# EasyEDA Pro project 鱼缸控制器(e-ink).epro, board 控制板pcb
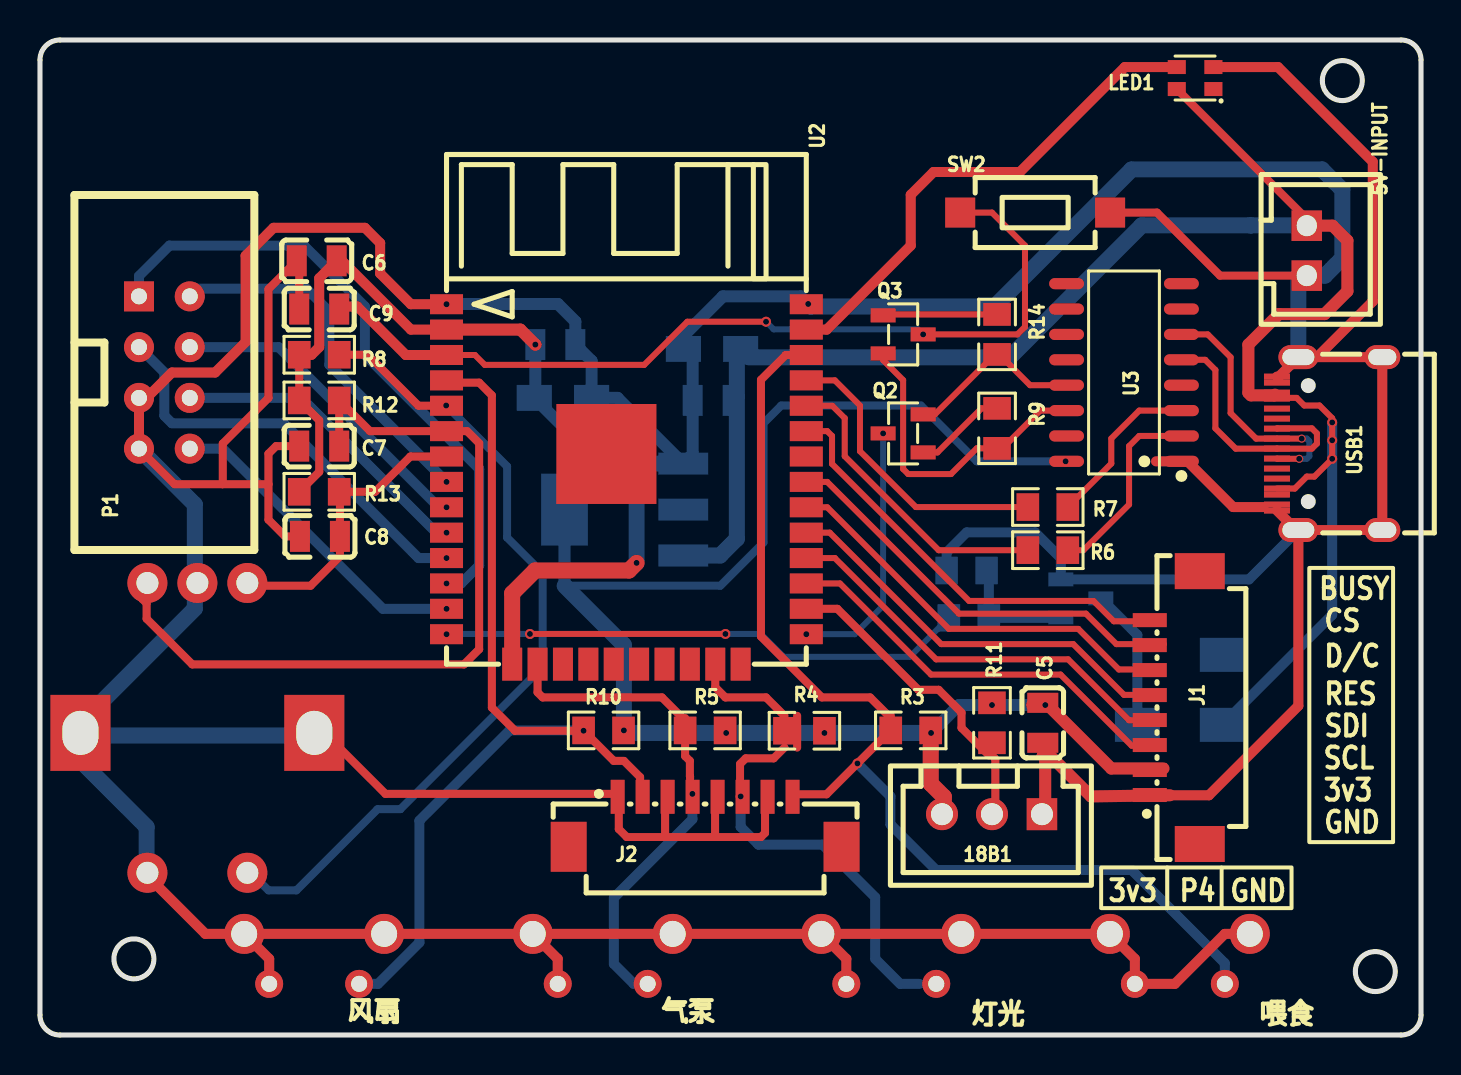
[diagram p4: board, top side]
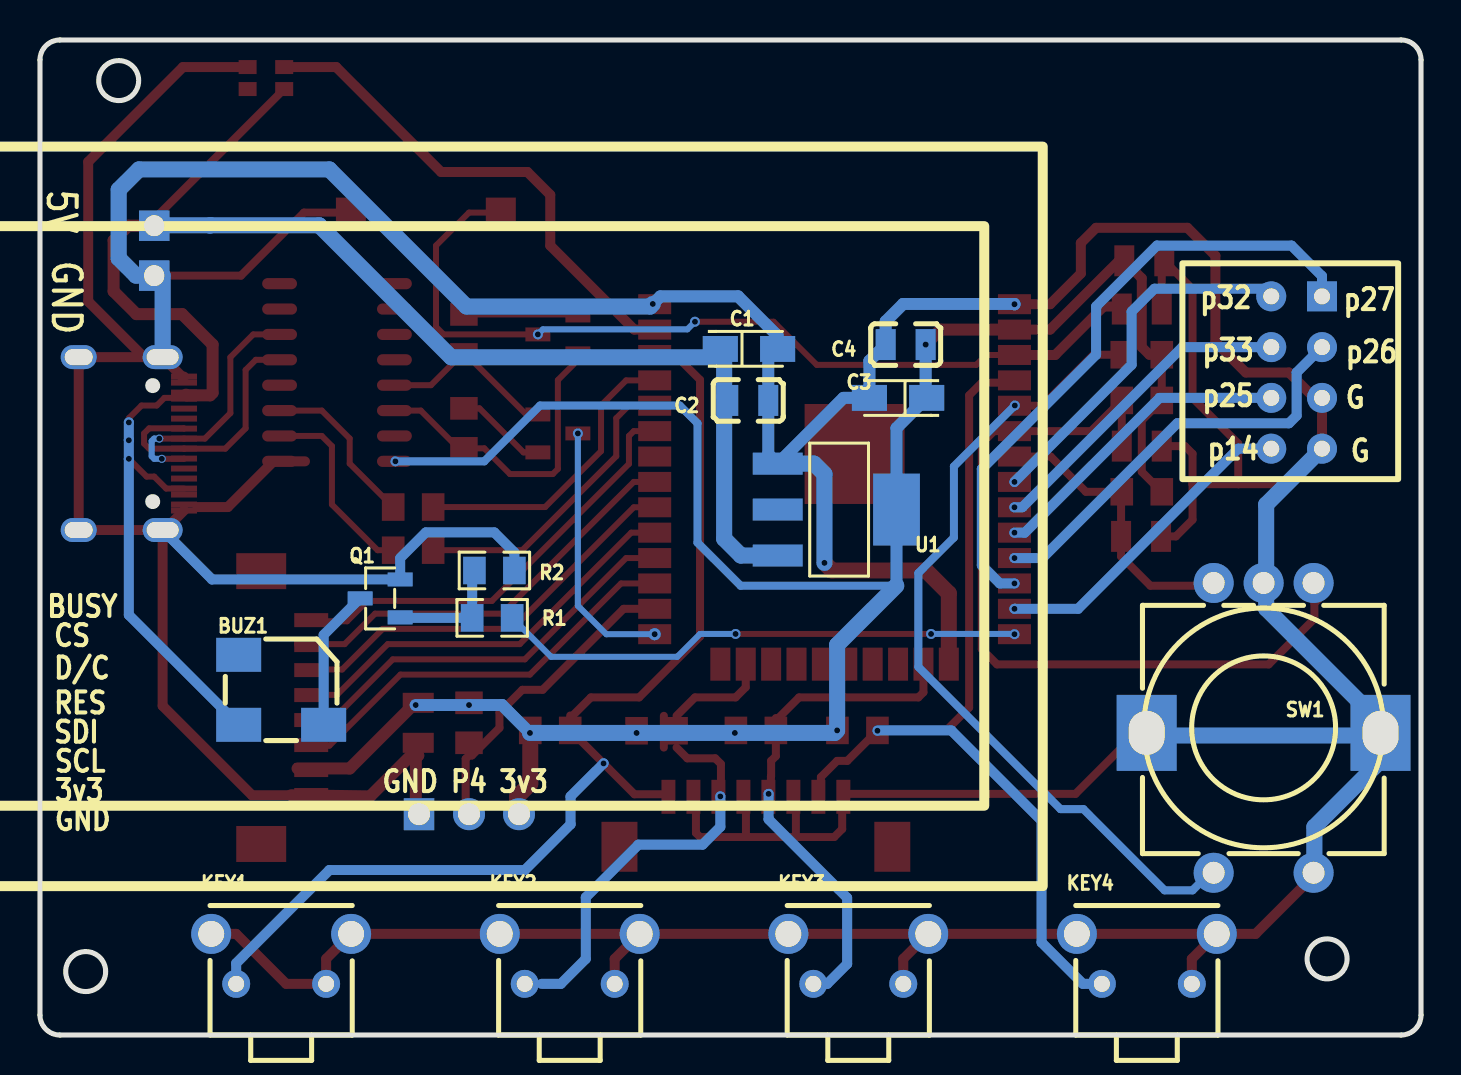
[diagram p5: board, bottom side, seen from below]

Outline 69.09 x 49.78 mm; copper layers: Top Layer, Bottom Layer. Coordinates in mm from the lower left corner of the outline.
Outline path: circle c4.7,3.81 r1 ; circle c65.15,47.75 r1 ; circle c66.8,3.17 r1 ; 0,48.78 0,1 arc(0.29,0.29) 1,0 68.09,0 arc(68.8,0.29) 69.09,1 69.09,48.78 arc(68.8,49.49) 68.09,49.78 1,49.78 arc(0.29,49.49) 0,48.78
Stack: Top Layer 0.035mm / Dielectric1 1.51mm FR4 er 4.5 / Bottom Layer 0.035mm

## Design rules (mm)
template: JLCPCB Capability(Two Layers Board)
spacing copperThickness1oz (default): track to track 0.102, other pairs 0.152 to 0.3
spacing copperThickness2oz: track to track 0.203, other pairs 0.152 to 0.3
track width copperThickness1oz (default): min 0.127, default 0.254, max 2.54
track width copperThickness2oz: min 0.203, default 0.254, max 2.54
differential pair differentialPair (default): width min 0.127, default 0.254, max 2.54; gap min 0.152, default 0.152
via viaSize (default): diameter min 0.5, default 0.61, max 10; hole min 0.3, default 0.305, max 6.3

## Placement (name value [footprint] x y rotation side)
5V-INPUT  SIP2  [conn-th_xh2.54-2p]  63.37 39.24 270 top
18B1  3PIN白色直针插座  [CONN-TH_3P-P2.50_3PIN]  47.62 11.05 180 top
BUZ1  5025贴片蜂鸣器  [BUZ-SMD_3P-L5.5-W5.0_5025]  57.02 17.27 180 bottom
C1  10uF  [CAP-SMD-钽_3216]  33.62 34.33 180 bottom
C2  0.1uf  [C0805]  33.66 31.75 0 bottom
C3  10uF  [CAP-SMD-钽_3216]  26.16 31.88 0 bottom
C4  0.1uf  [C0805]  25.78 34.54 180 bottom
C5  0.1uf  [C0805]  50.16 15.62 90 top
C6  0.1uf  [C0805]  13.84 38.73 0 top
C7  10p  [C0805]  13.97 29.46 0 top
C8  10p  [C0805]  14 24.95 0 top
C9  10uF  [C0805]  13.97 36.32 0 top
J1  单排排针  [CONN-SMD_8P-P1.25_XUNPU_WAFER-MX1.25-8PWB]  56.77 16.38 90 top
J2  单排排针  [CONN-SMD_8P-P1.25_XUNPU_WAFER-MX1.25-8PWB]  33.27 10.67 0 top
KEY1  6*6*4.3 带支架 260g  [KEY-TH_TL1105VF100Q]  57.02 3.81 180 bottom
KEY2  6*6*4.3 带支架 260g  [KEY-TH_TL1105VF100Q]  42.59 3.81 180 bottom
KEY3  6*6*4.3 带支架 260g  [KEY-TH_TL1105VF100Q]  28.15 3.81 180 bottom
KEY4  6*6*4.3 带支架 260g  [KEY-TH_TL1105VF100Q]  13.72 3.81 180 bottom
LED1  WS2812B-2020  [LED-SMD_4P-L2.0-W2.0-TL_WS2812B-2020]  57.78 47.88 180 top
P1  -  [DC3-8P]  6.22 33.15 90 top
Q1  -  [SOT-23-3_L2.9-W1.3-P1.90-LS2.4-BR]  52.07 21.84 180 bottom
Q2  -  [SOT-23-3_L2.9-W1.3-P1.90-LS2.4-BR]  43.18 30.1 0 top
Q3  -  [SOT-23-3_L2.9-W1.3-P1.90-LS2.4-BR]  43.18 35.05 180 top
R1  1k  [R0805]  46.47 20.87 180 bottom
R2  10k  [R0805]  46.35 23.24 0 bottom
R3  10k  [R0805]  43.56 15.24 0 top
R4  10k  [R0805]  38.24 15.22 0 top
R5  10k  [R0805]  33.27 15.24 0 top
R6  120R  [R0805]  50.42 24.26 0 top
R7  120R  [R0805]  50.42 26.42 0 top
R8  10k  [R0805]  13.97 34.04 180 top
R9  10k  [R0805]  47.88 30.35 90 top
R10  10k  [R0805]  28.19 15.24 0 top
R11  4.7k  [R0805]  47.62 15.62 90 top
R12  10k  [R0805]  13.97 31.75 0 top
R13  10k  [R0805]  13.97 27.18 180 top
R14  10k  [R0805]  47.88 35.05 90 top
SW1  EC11S  [SW-TH_EC11S]  7.87 15.37 0 bottom
SW2  BUTTON2,KEY  [KEY-SMD_L6.0-W3.5-LS8.0]  49.78 41.15 0 top
U1  AMS1117-3.3  [SOT-223-3_L6.5-W3.4-P2.30-LS7.0-BR]  29.21 26.29 0 bottom
U2  -  [wifim-smd_esp-32s]  29.34 27.56 270 top
U3  -  [SOP-16_L10.0-W3.9-P1.27-LS6.0-BL]  54.23 33.15 90 top
USB1  -  [USB-C_SMD-TYPE-C-31-M-12]  64.52 29.59 90 top

## Footprints (pads in the part's own frame, mm; a bottom-side part is the same pattern mirrored in y, then rotated)
BUZ-SMD_3P-L5.5-W5.0_5025
  rect 2.25x1.7 smd: 1(-2.125,1.75) 2(-2.125,-1.75) 3(2.125,-1.75)
C0805
  rect 1x1.55 smd: 1(-1,0) 2(1,0)
CAP-SMD-钽_3216
  rect 1.758x1.296 smd: 1(-1.433,0) 2(1.433,0)
CONN-SMD_8P-P1.25_XUNPU_WAFER-MX1.25-8PWB
  rect 0.7x1.7 smd: 1(-4.375,1.25) 2(-3.125,1.25) 3(-1.875,1.25) 4(-0.625,1.25) 5(0.625,1.25) 6(1.875,1.25) 7(3.125,1.25) 8(4.375,1.25)
  rect 1.8x2.5 smd: 9(6.825,-1.25) 10(-6.825,-1.25)
CONN-TH_3P-P2.50_3PIN
  rect 1.524x1.6 hole 1.1: 1(-2.5,0)
  round 1.6 hole 1.1: 2(0,0) 3(2.5,0)
conn-th_xh2.54-2p
  rect 1.524x1.524 hole 1.049x1.001: 1(-1.25,0) 2(1.25,0)
DC3-8P
  rect 1.5x1.5 hole 0.8: 1(3.81,1.27)
  round 1.5 hole 0.8: 2(3.81,-1.27) 3(1.27,1.27) 4(1.27,-1.27) 5(-1.27,1.27) 6(-1.27,-1.27) 7(-3.81,1.27) 8(-3.81,-1.27)
KEY-SMD_L6.0-W3.5-LS8.0
  rect 1.5x1.5 smd: 1(-3.75,0) 2(3.75,0)
KEY-TH_TL1105VF100Q
  round 2 hole 1.3: 0(-3.5,1.25) 0(3.5,1.25)
  round 1.4 hole 0.8: 1(-2.25,-1.25) 2(2.25,-1.25)
LED-SMD_4P-L2.0-W2.0-TL_WS2812B-2020
  rect 0.9x0.7 smd: 1(-0.915,0.55) 2(-0.915,-0.55) 3(0.915,-0.55) 4(0.915,0.55)
R0805
  rect 1.133x1.377 smd: 1(-1,0) 2(1,0)
SOP-16_L10.0-W3.9-P1.27-LS6.0-BL
  oval 0.559x1.745 smd: 1(-4.445,-2.873) 2(-3.175,-2.873) 3(-1.905,-2.873) 4(-0.635,-2.873) 5(0.635,-2.873) 6(1.905,-2.873) 7(3.175,-2.873) 8(4.445,-2.873) 9(4.445,2.873) 10(3.175,2.873) 11(1.905,2.873) 12(0.635,2.873) 13(-0.635,2.873) 14(-1.905,2.873) 15(-3.175,2.873) 16(-4.445,2.873)
SOT-23-3_L2.9-W1.3-P1.90-LS2.4-BR
  rect 1.25x0.701 smd: 1(1.001,-0.95) 2(1.001,0.95) 3(-1.001,0)
SOT-223-3_L6.5-W3.4-P2.30-LS7.0-BR
  rect 2.5x1.1 smd: 1(2.97,-2.3) 2(2.97,0) 3(2.97,2.3)
  rect 2.34x3.6 smd: 4(-2.97,0)
SW-TH_EC11S
  rect 3x3.8 hole 1.8x2.2: 0(-5.85,0.25) 0(5.85,0.25)
  round 2 hole 1.1: A(-2.5,-7.25) B(2.5,-7.25) C(0,-7.25) S1(-2.5,7.25) S2(2.5,7.25)
USB-C_SMD-TYPE-C-31-M-12
  oval 1.199x1.999 hole 0.8x1.6: 0(-4.325,1.565) 0(4.325,1.565)
  oval 1.199x1.801 hole 0.8x1.399: 0(-4.325,-2.634) 0(4.325,-2.634)
  rect 0.299x1.3 smd: A1(-3.35,2.634) A4(-2.55,2.634) A5(-1.25,2.634) A6(-0.249,2.634) A7(0.249,2.634) A8(1.25,2.634) A9(2.55,2.634) A12(3.35,2.634) B1(3.05,2.634) B4(2.251,2.634) B5(1.75,2.634) B6(0.75,2.634) B7(-0.75,2.634) B8(-1.75,2.634) B9(-2.251,2.634) B12(-3.05,2.634)
wifim-smd_esp-32s
  rect 1.001x1.651 smd: 1(-9.005,-8.999) 2(-7.734,-8.999) 3(-6.465,-8.999) 4(-5.194,-8.999) 5(-3.925,-8.999) 6(-2.655,-8.999) 7(-1.385,-8.999) 8(-0.115,-8.999) 9(1.155,-8.999) 10(2.425,-8.999) 11(3.696,-8.999) 12(4.965,-8.999) 13(6.236,-8.999) 14(7.505,-8.999) 25(7.505,8.999) 26(6.236,8.999) 27(4.965,8.999) 28(3.696,8.999) 29(2.425,8.999) 30(1.155,8.999) 31(-0.115,8.999) 32(-1.385,8.999) 33(-2.655,8.999) 34(-3.925,8.999) 35(-5.194,8.999) 36(-6.465,8.999) 37(-7.734,8.999) 38(-9.005,8.999)
  rect 1.651x1.001 smd: 15(9.005,-5.715) 16(9.005,-4.445) 17(9.005,-3.175) 18(9.005,-1.905) 19(9.005,-0.635) 20(9.005,0.635) 21(9.005,1.905) 22(9.005,3.175) 23(9.005,4.445) 24(9.005,5.715)
  rect 5.002x5.002 smd: 39(-1.512,-1.001)

## Nets
As in the schematic.

Pads without a net: BUZ1 1; J1 9 10; J2 9 10; LED1 1; U1 2; U2 32 39; U3 4 7 8 9 10 11 12 15; USB1 A5 A8 B5 B8

## Via types
v1: diameter 0.5, hole 0.3, Top Layer to Bottom Layer, 29 vias
v2: diameter 0.61, hole 0.305, Top Layer to Bottom Layer, 3 vias
v3: diameter 0.4, hole 0.3, Top Layer to Bottom Layer, 2 vias

## Routing (per net, layer and track width the routed paths; a pad name or vN(x,y) marks a point on that pad's centre or on a via; arc(x,y) is an arc through that point)
+3.3V: length 113.2
  Top Layer w0.4: R13.2 13.97,28.18 13.97,30.75 R12.1 R8.2
  Top Layer w0.5: R8.2 13.59,34.04 13.97,34.42 13.97,37.86 C6.2 15.11,38.73 18.55,35.29 U2.2
  Top Layer w0.6: 49.64,16.51 50.42,16.51 53.59,13.33 56.2,13.33 ; U2.2 24.03,35.29 v2(24.78,34.54)
  Top Layer w0.8: 44.56,14.48 44.56,12.57 45.22,11.92 45.22,11.14 18B1.3
  Bottom Layer w0.4: v1(51.31,28.7) 46.86,28.7 44.07,31.5 37.08,31.5 36.19,30.61 36.19,24.64 34.04,22.48 26.25,22.48 26.24,22.49
  Bottom Layer w0.6: 26.24,22.49 U1.4 26.24,30.37 C3.1 24.78,31.93 v2(24.78,34.54) ; v1(50.29,16.51) v1(47.62,16.51) 45.97,16.51 v1(44.58,15.11)
  Bottom Layer w0.8: 26.25,22.48 29.21,19.52 v1(29.21,15.24) 29.34,15.11 v1(34.33,15.11) v1(39.24,15.11) v1(44.58,15.11)
+5V: length 94.5
  Top Layer w0.3: USB1.A9 62.15,31.88 62.87,31.88 63.25,31.5 64.01,31.5 64.64,30.86 v1(64.64,29.76) v1(64.64,28.83) 63.75,27.94 63.37,27.94 62.77,27.34 USB1.B9
  Top Layer w0.4: 5V-INPUT.1 63.37,40.83 LED1.4
  Top Layer w0.6: 5V-INPUT.1 64.66,40.49 65.41,39.75 65.41,37.21 64.26,36.07 61.98,36.07 60.45,34.54 60.45,32.13 60.58,32 61.75,32 61.78,32.04
  Bottom Layer w0.5: v1(64.64,30.65) v1(64.64,29.76) v1(64.64,28.83) 64.64,21.02 BUZ1.2
  Bottom Layer w0.6: 34.86,31.96 C2.2
  Bottom Layer w0.8: 60.56,40.51 63.35,40.51 5V-INPUT.1 ; 60.56,40.51 55.12,40.51 48.51,33.91 35.47,33.91 C1.1 34.86,34.14 34.86,24.83 34.02,23.99 U1.3 ; 60.56,40.51 60.58,40.49
GND-S: length 392.2
  Top Layer w0.4: 11.43,27.56 11.43,25.78 12.26,24.95 C8.1 13,24.45 ; 11.43,27.56 11.43,29.08 11.81,29.46 C7.1 ; 11.43,27.56 9.13,27.56 ; 13.22,14.23 13.97,14.99 14.36,14.99 17.28,12.06 28.73,12.06 28.96,11.84 28.96,10.31 29.36,9.91 31.27,9.91 ; C9.1 12.97,38.61 C6.1 11.43,37.32 11.43,31.88 9.14,29.59 9.14,27.57 9.13,27.56 ; SW2.2 55.88,41.15 59.03,37.99 5V-INPUT.2 ; P1.7 6.73,27.56 9.13,27.56 ; 33.66,9.91 33.77,10.02 33.77,12.05 ; 33.66,9.91 31.27,9.91 ; 33.66,9.91 36.07,9.91 36.27,10.11 36.27,12.05 ; 31.27,9.91 31.27,12.05
  Top Layer w0.5: 55.83,28.7 57.4,28.7 59.69,26.42 61.21,26.42 ; KEY1.0 59.27,5.06 56.77,2.56 KEY1.2 54.77,3.81 KEY1.0 KEY2.0 KEY2.0 ; LED1.2 61.93,48.43 66.67,43.69 66.67,36.7 63.89,33.92 ; USB1.0 USB1.0 USB1.0 63.89,33.92 ; USB1.0 62.95,16.47 58.48,12 56.52,12 ; USB1.0 62.86,25.27 USB1.A1 ; KEY3.0 KEY3.0 KEY2.0 ; KEY3.0 25.9,3.81 KEY3.2 ; KEY3.0 KEY4.0 KEY4.0 ; 63.89,33.92 USB1.0 61.98,32.94 USB1.A12 ; P1.7 4.95,31.5 6.6,33.15 8.76,33.15 10.29,34.67 10.29,38.99 11.68,40.39 16.26,40.39 17.02,39.62 17.02,38.1 18.55,36.56 v2(20.34,36.56) ; KEY4.0 8.27,5.06 5.22,8.12 4.87,8.12 ; KEY4.0 11.47,3.81 KEY4.2 ; KEY2.0 40.34,3.81 KEY2.2
  Top Layer w0.6: 18B1.1 50.29,11.21 50.29,13.86 50.16,13.99 50.53,13.99 52.58,11.94 56.52,12
  Top Layer w0.8: v1(29.84,23.62) 29.46,23.24 24.76,23.24 23.62,22.1 U2.15
  Bottom Layer w0.5: R2.1 45.35,24.15 46.35,25.15 49.78,25.15 51.07,23.86 Q1.2 60.48,22.79 USB1.0
  Bottom Layer w0.6: v1(38.43,36.58) 38.05,36.96 34.16,36.96 32.19,34.98 32.19,34.33 32.66,33.86 C2.1 32.66,29.06 U1.1 28.89,31.88 C3.2 27.59,33.73 C4.1 26.78,35.7 25.91,36.58 20.35,36.58 v2(20.34,36.56)
  Bottom Layer w0.8: v1(38.43,36.58) 38.56,36.45 47.75,36.45 54.61,43.31 64.13,43.31 65.15,42.29 65.15,38.86 64.28,37.99 5V-INPUT.2 62.95,37.99 USB1.0 ; 4.87,8.12 5.33,8.58 5.33,10.41 1.52,14.23 ; 13.22,14.23 12.46,14.99 2.27,14.99 1.52,14.23 ; 1.52,14.23 1.52,15.11 7.75,21.34 7.75,26.54 P1.7 ; v1(29.84,23.62) 29.84,28.07 30.37,28.59 U1.1
CH340_DN: length 13.1
  Top Layer w0.3: USB1.B7 61.89,28.83 v3(62.99,28.83) ; 56.72,35.05 58.42,35.05 59.56,33.91 59.56,31.11 60.84,29.84 USB1.A7 v3(63.12,29.84)
  Bottom Layer w0.3: v3(63.12,29.84) 63.38,29.84 63.5,29.72 63.5,28.96 63.37,28.83 v3(62.99,28.83)
CH340_DP: length 13.4
  Top Layer w0.3: USB1.B6 61.89,30.35 63.63,30.35 63.88,30.1 63.88,29.59 63.63,29.34 61.88,29.34 ; 61.88,29.34 59.82,29.34 58.8,30.35 58.8,33.27 58.29,33.78 U3.5 56.72,33.78 ; 61.88,29.34 USB1.A6
CH340_DTR: length 9
  Top Layer w0.3: Q2.2 44.76,31.05 47.67,33.95 48.09,33.95 49.53,32.51 U3.13
CH340_RTS: length 15.8
  Top Layer w0.3: 42.18,34.1 42.18,33.77 43.18,32.77 43.18,28.32 43.43,28.07 45.58,28.07 46.86,29.35 48.15,29.35 50.04,31.24 U3.14
EN: length 44.9
  Top Layer w0.3: v1(36.32,35.69) 32.38,35.69 30.23,33.53 22.25,33.53 21.76,34.02 U2.3 ; SW2.1 47.62,41.15 49.28,39.5 49.28,35.43 48.89,35.05 v1(44.18,35.05)
  Top Layer w0.5: U2.3 18.3,34.02 15.88,36.45 15.1,36.45 C9.2
  Bottom Layer w0.3: v1(36.32,35.69) 36.7,35.31 43.93,35.31 v1(44.18,35.05)
EXT(P36): length 48.2
  Top Layer w0.4: v1(27.19,15.22) R10.1 ; v1(27.19,15.22) 23.76,15.22 22.61,16.38 22.61,32 21.97,32.64 20.45,32.64 U2.4 ; v1(27.19,15.22) 28.7,13.72 29.21,13.72 30.02,12.9 30.02,12.05
  Bottom Layer w0.5: 27.18,15.24 23.5,15.24 18.98,10.73 18.98,4.63 16.91,2.56 KEY4.1 15.71,2.56
P0: length 13.1
  Bottom Layer w0.3: v2(38.34,20.05) 40.75,20.05 42.18,21.48 v1(42.18,30.1)
P4: length 15.9
  Top Layer w0.4: 18B1.2 47.79,11.22 47.79,13.82 47.62,13.99 47.48,13.99 46.1,15.37 46.1,16.13 44.96,17.27 43.94,17.27 39.89,21.32 U2.26
P5: length 20.5
  Top Layer w0.3: U2.29 39.51,25.13 45.09,19.56 51.69,19.56 54.23,17.02 55.51,17.02 J1.5
P12: length 26.4
  Top Layer w0.3: v1(24.51,20.07) v1(34.29,20.07)
  Bottom Layer w0.3: v1(24.51,20.07) 20.35,20.07 v1(20.34,20.05) ; v1(34.29,20.07) 36.07,20.07 37.21,18.92 43.52,18.92 R1.2
P13: length 25
  Top Layer w0.4: 32.52,12.05 32.52,12.94 32.51,12.95 32.51,13.72 32.27,13.95 R5.1 ; U2.16 24.89,17.14 25.15,16.89 31.12,16.89 32.27,15.73 32.27,15.86
  Bottom Layer w0.5: v1(32.64,12.06) 32.64,10.8 28.71,6.86 28.71,3.56 29.7,2.56 KEY3.1
P14-PWM: length 16.2
  Bottom Layer w0.5: P1.8 9.14,29.34 17.16,21.32 v1(20.34,21.32)
P15: length 26.4
  Top Layer w0.4: 37.88,14.38 37.88,15.97 ; 37.24,14.38 36.7,13.84 35.31,13.84 35.02,13.56 35.02,12.05 35.05,12.08 ; U2.23 33.78,17.4 34.29,16.89 36.32,16.89 37.24,15.97
  Bottom Layer w0.5: v1(35.05,11.94) 35.05,10.41 35.94,9.53 39.15,9.53 41.78,6.89 41.78,3.81 43.03,2.56 43.99,2.56
P16: length 20.6
  Top Layer w0.3: U2.27 40.02,22.59 44.58,18.03 51.05,18.03 54.61,14.48 55.49,14.48 J1.3
P17: length 20.5
  Top Layer w0.3: U2.28 39.76,23.86 44.83,18.8 51.44,18.8 54.48,15.75 55.51,15.75 J1.4
P18: length 20.6
  Top Layer w0.3: U2.30 39.38,26.4 45.47,20.32 51.94,20.32 53.97,18.29 55.49,18.29 J1.6
P19: length 21.3
  Top Layer w0.3: 56.23,19.56 53.85,19.56 52.32,21.08 45.97,21.08 39.38,27.67 U2.31
P21: length 22
  Top Layer w0.3: J1.8 55.46,20.7 53.72,20.7 52.7,21.72 46.48,21.72 39.62,28.58 39.62,29.97 39.38,30.21 U2.33
P22: length 55.6
  Top Layer w0.4: 42.56,15.26 R3.1 ; 42.56,15.26 42.8,15.49 ; 42.56,15.26 v1(40.89,13.59) 39.35,12.05 37.52,12.05 ; 42.56,15.26 42.56,15.86 ; 42.56,15.86 41.53,16.89 39.12,16.89 36.07,19.94 36.07,32.78 37.31,34.02 U2.36 ; 42.56,15.86 42.56,15.99
  Bottom Layer w0.5: KEY1.1 59.27,3.59 54.61,8.25 44.83,8.25 42.54,10.54 42.54,11.94 v1(40.89,13.59)
P25: length 15.6
  Bottom Layer w0.5: P1.6 13.08,31.88 19.82,25.13 v1(20.34,25.13)
P26: length 21
  Bottom Layer w0.5: P1.3 6.22,33.15 6.22,30.99 6.6,30.61 12.19,30.61 18.94,23.86 v1(20.34,23.86)
P27: length 31.5
  Bottom Layer w0.5: P1.1 4.95,37.97 6.48,39.5 13.21,39.5 16.26,36.45 16.26,34.04 21.97,28.32 21.97,23.5 21.07,22.59 v1(20.34,22.59)
P32: length 18.6
  Bottom Layer w0.5: P1.2 7.87,37.34 13.33,37.34 14.48,36.19 14.48,33.53 v1(20.34,27.67)
P33: length 16.2
  Bottom Layer w0.5: P1.4 11.94,34.42 19.95,26.4 v1(20.34,26.4)
P34: length 40.3
  Top Layer w0.4: C7.2 R12.2 16.51,30.21 U2.6 21.36,30.21 21.97,29.61 21.97,19.3 21.21,18.54 7.62,18.54 5.33,20.83 5.33,21.6 5.12,21.81 5.12,22.62
P35: length 14.6
  Top Layer w0.4: U2.7 18.53,28.94 16.76,27.18 15.04,27.18 15,27.14 ; SW1.B 10.51,22.48 13.54,22.48 15,23.95 C8.2 15,27.14 ; 15,27.14 R13.1
SVN(P39): length 41.5
  Top Layer w0.4: U2.5 18.94,31.48 16.38,34.04 R8.1
  Bottom Layer w0.4: 10.12,8.12 10.55,8.12 11.43,7.24 12.83,7.24 16.89,11.3 18.03,11.3 25.15,18.42 25.15,23.11 23.37,24.89 23.37,28.45 v1(20.32,31.5)
U0RXD: length 15.3
  Top Layer w0.3: U2.34 39.64,31.48 40.26,30.86 40.26,28.96 44.96,24.26 49.55,24.26
U0TXD: length 15.2
  Top Layer w0.3: 49.55,26.42 43.81,26.42 41.02,29.21 41.02,31.5 39.76,32.75 U2.35
WS2812-DIN: length 25.5
  Top Layer w0.5: U2.37 39.36,35.29 43.56,39.5 43.56,42.04 44.7,43.18 49.02,43.18 54.27,48.43 LED1.3
$1N3073: length 9.8
  Top Layer w0.3: 57.1,29.97 54.99,29.97 54.48,29.46 54.48,26.54 52.2,24.26 R6.2
$1N3074: length 8.4
  Top Layer w0.3: R7.2 53.59,28.59 53.59,29.84 54.99,31.24 U3.3
$1N3352: length 4.6
  Top Layer w0.3: R9.2 47.1,31.35 44.9,29.15 Q2.1
$1N3353: length 5.7
  Top Layer w0.3: R14.2 42.23,36.05 Q3.1
$1N21870: length 6
  Bottom Layer w0.5: 51.07,20.89 51.05,20.87 R1.1 47.47,23.13 R2.2
$1N21896: length 7.1
  Bottom Layer w0.5: BUZ1.3 54.9,20.02 Q1.3

## Copper pours and planes (outline as drawn; the poured copper is in the pictures)
GND-S on Bottom Layer: -0.89,37.72 68.71,37.72 68.71,8.38 -0.89,8.38

## Text on the board
Bottom Silkscreen Layer: G | p26 | p27 | p14 | p33 | p25 | p32 | 3v3 | P4 | GND | SCL | CS | D/C | RES | SDI | BUSY | 5V
Top Silkscreen Layer: 3v3 | P4 | GND | BUSY | SCL | CS | D/C | RES | SDI | 风扇 | 气泵 | 灯光 | 喂食
